# Altium schematic sheet Controller.SchDoc
size A1
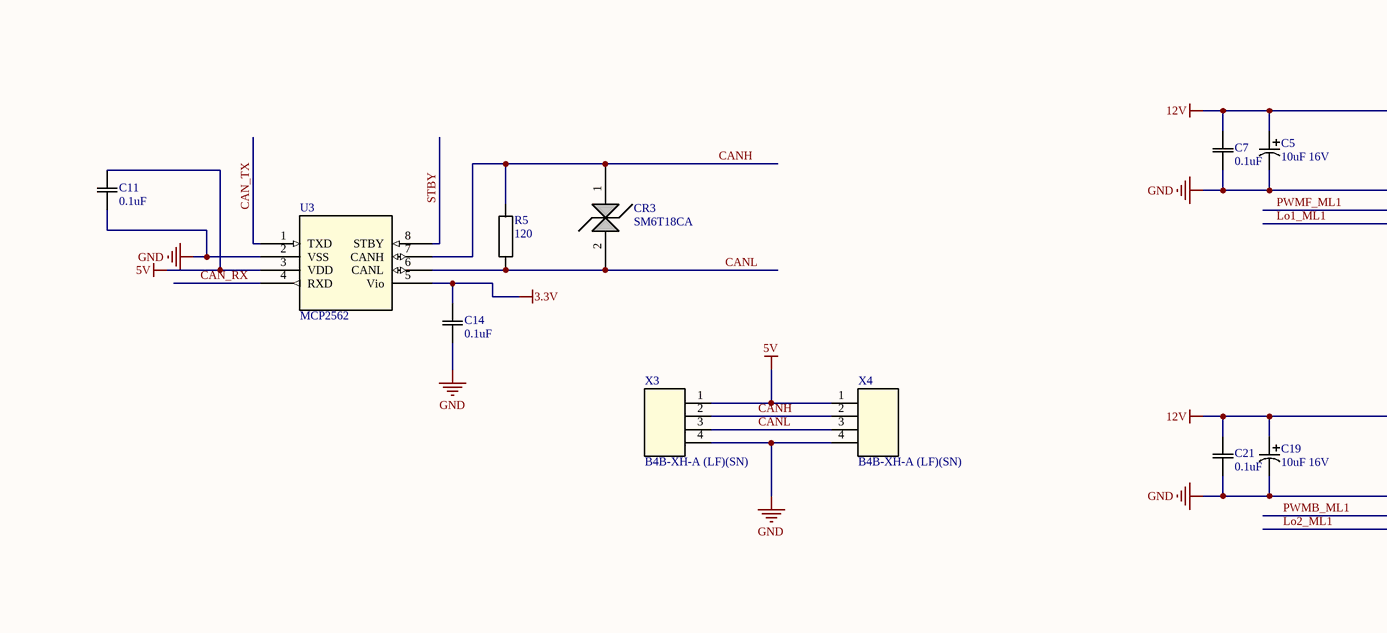
[diagram p0: Controller.SchDoc, top left]
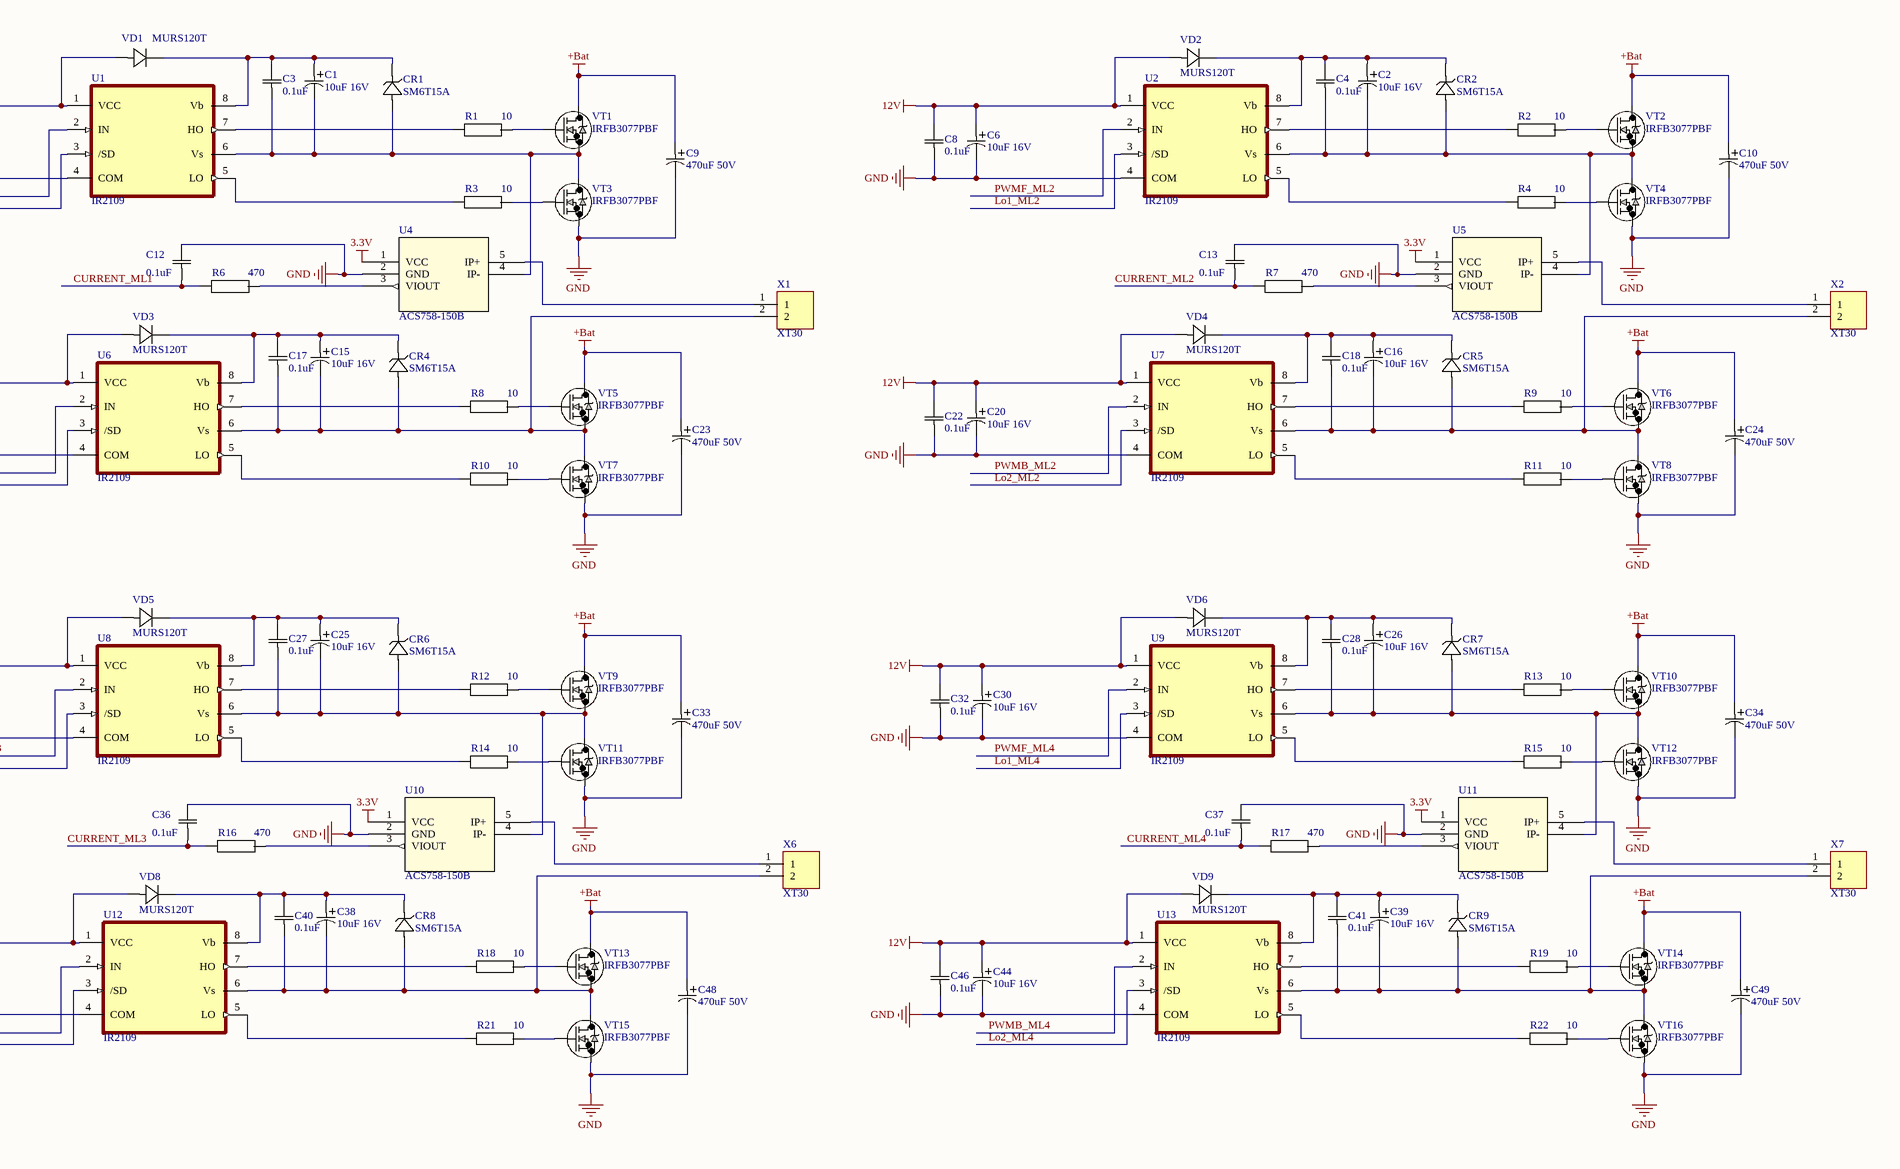
[diagram p1: Controller.SchDoc, top right]
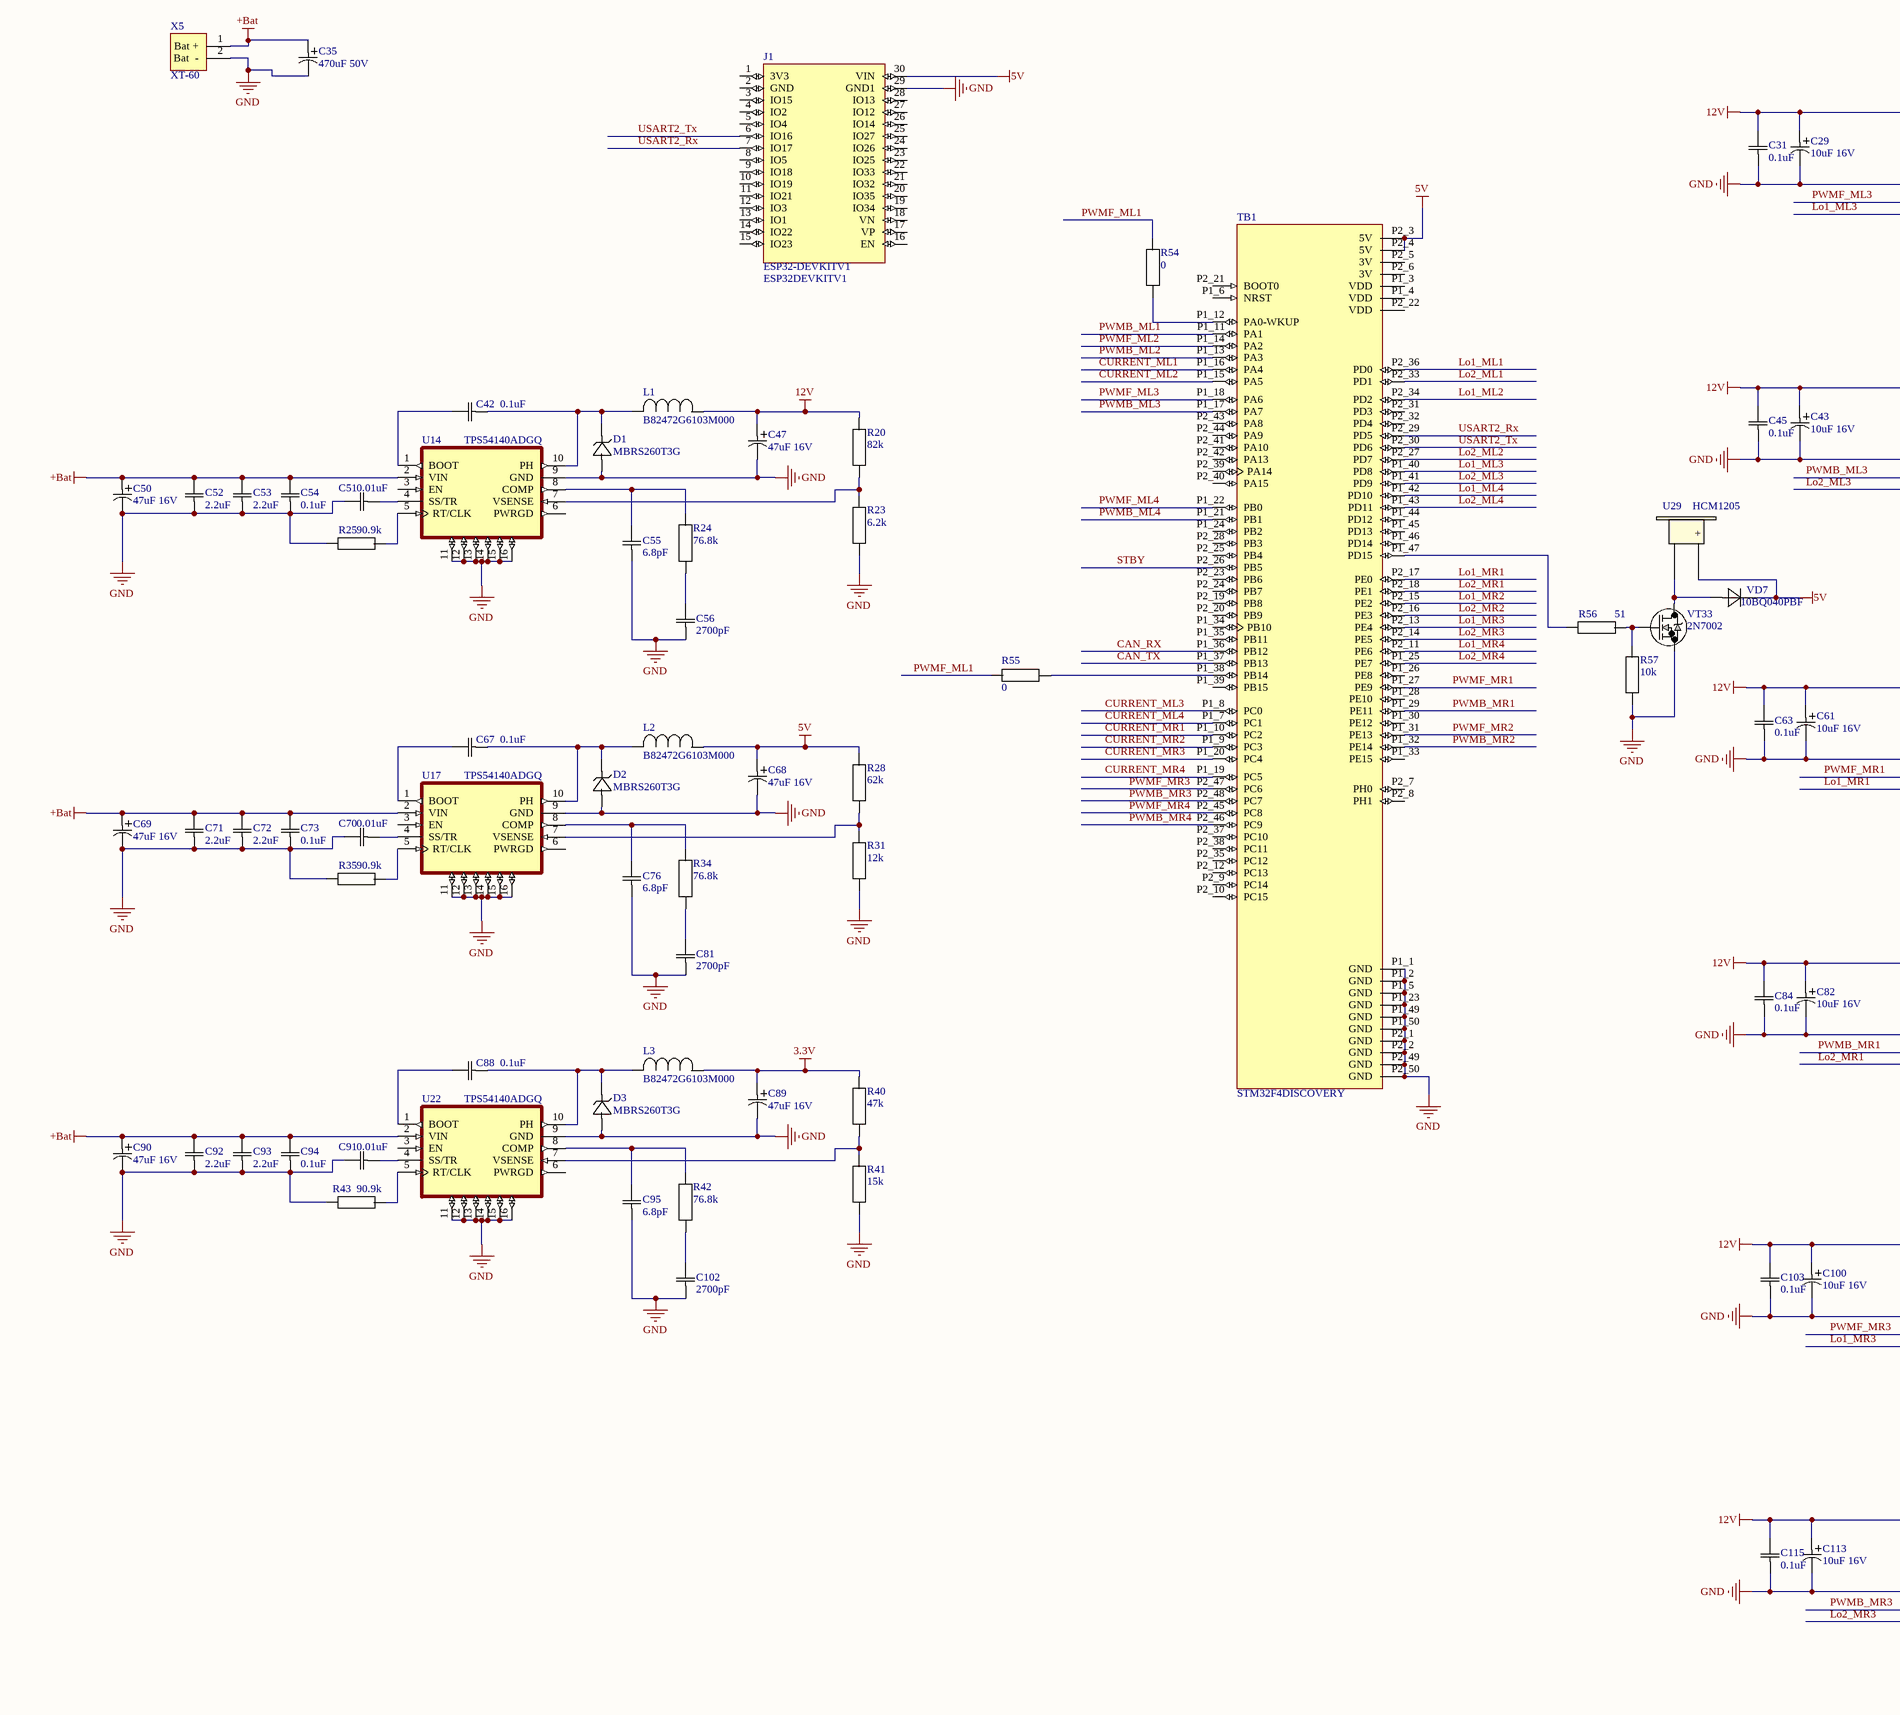
[diagram p2: Controller.SchDoc, bottom left]
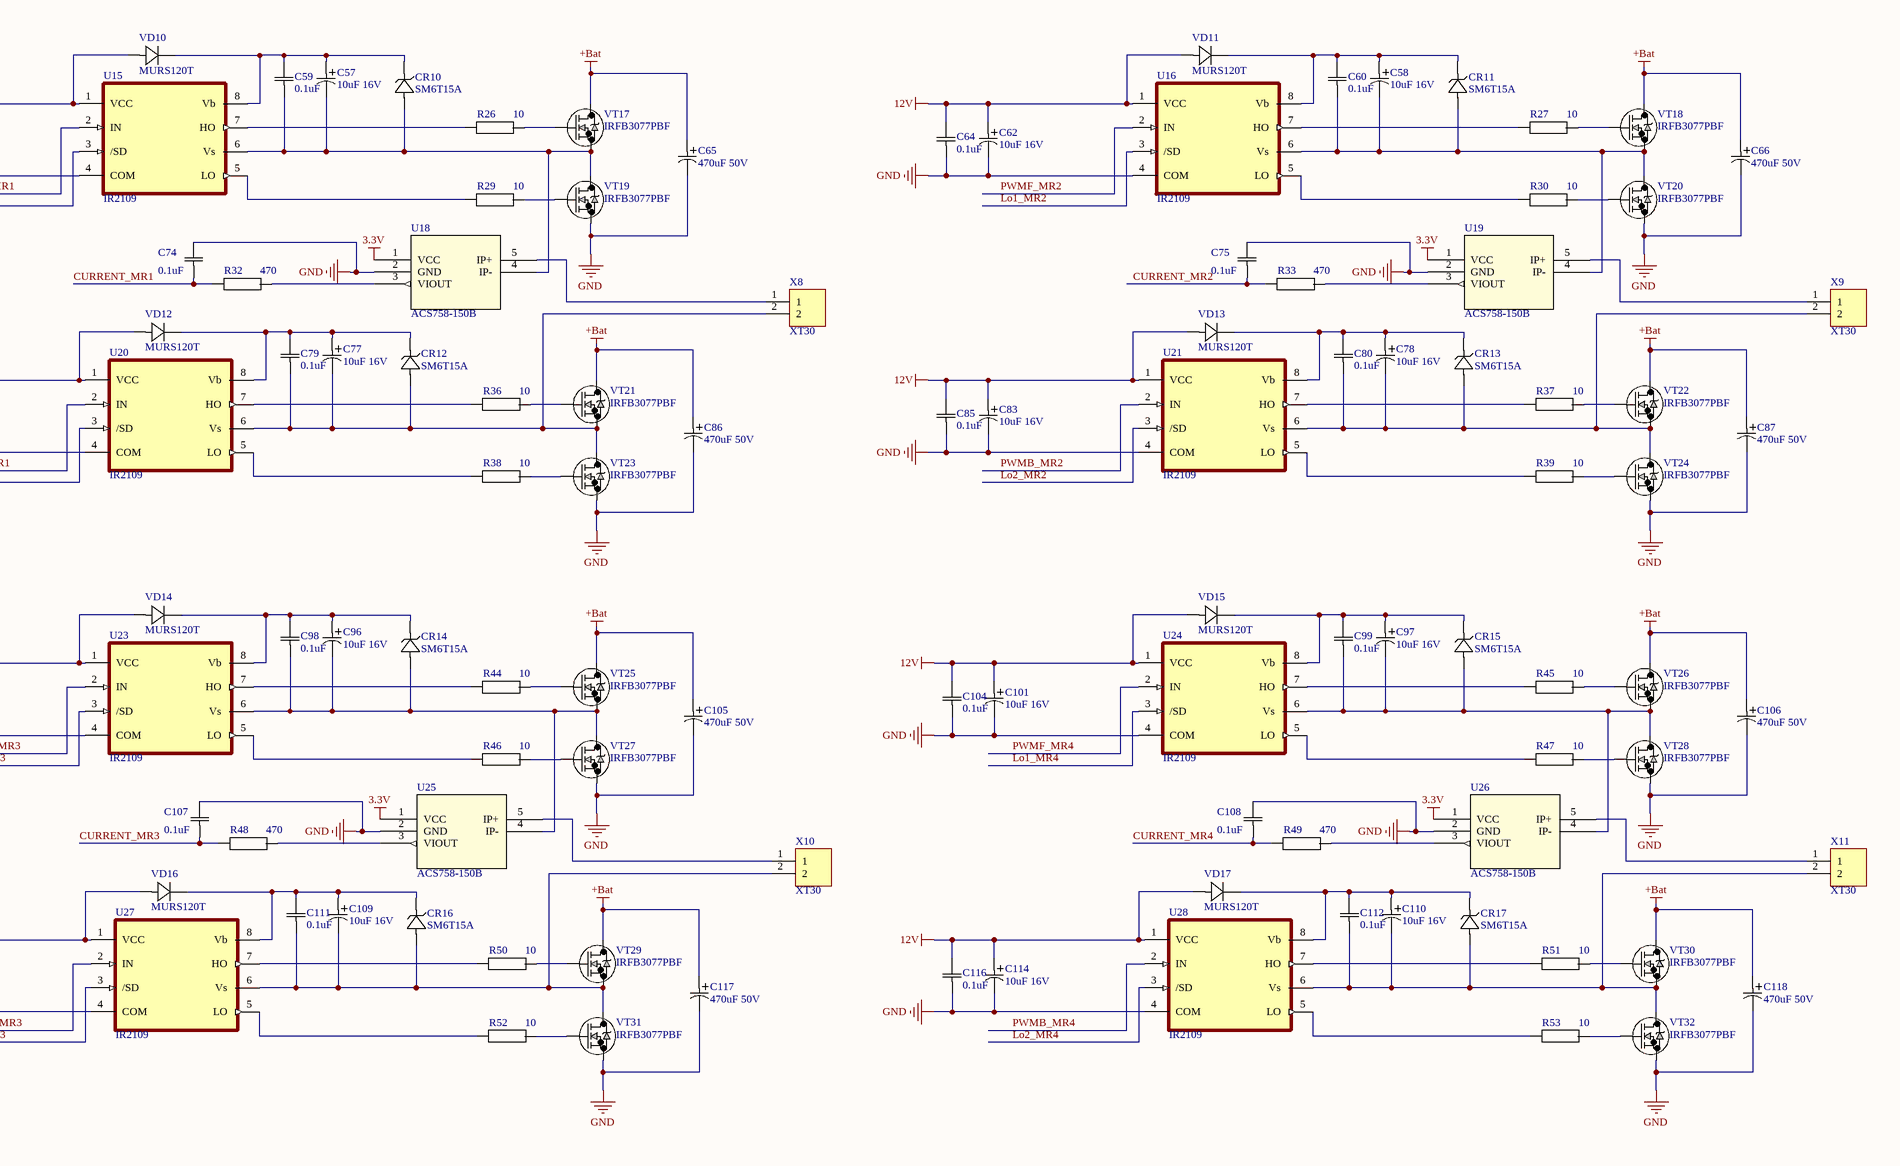
[diagram p3: Controller.SchDoc, bottom right]

## Parts
C1  10uF 16V  [PCAP_5x11-THRU-E]
C2  10uF 16V  [PCAP_5x11-THRU-E]
C3  0.1uF  [0603]
C4  0.1uF  [0603]
C5  10uF 16V  [PCAP_5x11-THRU-E]
C6  10uF 16V  [PCAP_5x11-THRU-E]
C7  0.1uF  [0603]
C8  0.1uF  [0603]
C9  470uF 50V  [CAP_UAQ_12P5X20]
C10  470uF 50V  [CAP_UAQ_12P5X20]
C11  0.1uF  [0603]
C12  0.1uF  [0603]
C13  0.1uF  [0603]
C14  0.1uF  [0603]
C15  10uF 16V  [PCAP_5x11-THRU-E]
C16  10uF 16V  [PCAP_5x11-THRU-E]
C17  0.1uF  [0603]
C18  0.1uF  [0603]
C19  10uF 16V  [PCAP_5x11-THRU-E]
C20  10uF 16V  [PCAP_5x11-THRU-E]
C21  0.1uF  [0603]
C22  0.1uF  [0603]
C23  470uF 50V  [CAP_UAQ_12P5X20]
C24  470uF 50V  [CAP_UAQ_12P5X20]
C25  10uF 16V  [PCAP_5x11-THRU-E]
C26  10uF 16V  [PCAP_5x11-THRU-E]
C27  0.1uF  [0603]
C28  0.1uF  [0603]
C29  10uF 16V  [PCAP_5x11-THRU-E]
C30  10uF 16V  [PCAP_5x11-THRU-E]
C31  0.1uF  [0603]
C32  0.1uF  [0603]
C33  470uF 50V  [CAP_UAQ_12P5X20]
C34  470uF 50V  [CAP_UAQ_12P5X20]
C35  470uF 50V  [CAP_UAQ_12P5X20]
C36  0.1uF  [0603]
C37  0.1uF  [0603]
C38  10uF 16V  [PCAP_5x11-THRU-E]
C39  10uF 16V  [PCAP_5x11-THRU-E]
C40  0.1uF  [0603]
C41  0.1uF  [0603]
C42  0.1uF  [0603]
C43  10uF 16V  [PCAP_5x11-THRU-E]
C44  10uF 16V  [PCAP_5x11-THRU-E]
C45  0.1uF  [0603]
C46  0.1uF  [0603]
C47  47uF 16V  [PCAP_5x11-THRU-E]
C48  470uF 50V  [CAP_UAQ_12P5X20]
C49  470uF 50V  [CAP_UAQ_12P5X20]
C50  47uF 16V  [PCAP_5x11-THRU-E]
C51  0.01uF  [0603]
C52  2.2uF  [CAP_0805J_AVX]
C53  2.2uF  [CAP_0805J_AVX]
C54  0.1uF  [0603]
C55  6.8pF  [0603]
C56  2700pF  [0603]
C57  10uF 16V  [PCAP_5x11-THRU-E]
C58  10uF 16V  [PCAP_5x11-THRU-E]
C59  0.1uF  [0603]
C60  0.1uF  [0603]
C61  10uF 16V  [PCAP_5x11-THRU-E]
C62  10uF 16V  [PCAP_5x11-THRU-E]
C63  0.1uF  [0603]
C64  0.1uF  [0603]
C65  470uF 50V  [CAP_UAQ_12P5X20]
C66  470uF 50V  [CAP_UAQ_12P5X20]
C67  0.1uF  [0603]
C68  47uF 16V  [PCAP_5x11-THRU-E]
C69  47uF 16V  [PCAP_5x11-THRU-E]
C70  0.01uF  [0603]
C71  2.2uF  [CAP_0805J_AVX]
C72  2.2uF  [CAP_0805J_AVX]
C73  0.1uF  [0603]
C74  0.1uF  [0603]
C75  0.1uF  [0603]
C76  6.8pF  [0603]
C77  10uF 16V  [PCAP_5x11-THRU-E]
C78  10uF 16V  [PCAP_5x11-THRU-E]
C79  0.1uF  [0603]
C80  0.1uF  [0603]
C81  2700pF  [0603]
C82  10uF 16V  [PCAP_5x11-THRU-E]
C83  10uF 16V  [PCAP_5x11-THRU-E]
C84  0.1uF  [0603]
C85  0.1uF  [0603]
C86  470uF 50V  [CAP_UAQ_12P5X20]
C87  470uF 50V  [CAP_UAQ_12P5X20]
C88  0.1uF  [0603]
C89  47uF 16V  [PCAP_5x11-THRU-E]
C90  47uF 16V  [PCAP_5x11-THRU-E]
C91  0.01uF  [0603]
C92  2.2uF  [CAP_0805J_AVX]
C93  2.2uF  [CAP_0805J_AVX]
C94  0.1uF  [0603]
C95  6.8pF  [0603]
C96  10uF 16V  [PCAP_5x11-THRU-E]
C97  10uF 16V  [PCAP_5x11-THRU-E]
C98  0.1uF  [0603]
C99  0.1uF  [0603]
C100  10uF 16V  [PCAP_5x11-THRU-E]
C101  10uF 16V  [PCAP_5x11-THRU-E]
C102  2700pF  [0603]
C103  0.1uF  [0603]
C104  0.1uF  [0603]
C105  470uF 50V  [CAP_UAQ_12P5X20]
C106  470uF 50V  [CAP_UAQ_12P5X20]
C107  0.1uF  [0603]
C108  0.1uF  [0603]
C109  10uF 16V  [PCAP_5x11-THRU-E]
C110  10uF 16V  [PCAP_5x11-THRU-E]
C111  0.1uF  [0603]
C112  0.1uF  [0603]
C113  10uF 16V  [PCAP_5x11-THRU-E]
C114  10uF 16V  [PCAP_5x11-THRU-E]
C115  0.1uF  [0603]
C116  0.1uF  [0603]
C117  470uF 50V  [CAP_UAQ_12P5X20]
C118  470uF 50V  [CAP_UAQ_12P5X20]
CR1  SM6T15A  [SMB_STM]
CR2  SM6T15A  [SMB_STM]
CR3  SM6T18CA  [SMB_STM]
CR4  SM6T15A  [SMB_STM]
CR5  SM6T15A  [SMB_STM]
CR6  SM6T15A  [SMB_STM]
CR7  SM6T15A  [SMB_STM]
CR8  SM6T15A  [SMB_STM]
CR9  SM6T15A  [SMB_STM]
CR10  SM6T15A  [SMB_STM]
CR11  SM6T15A  [SMB_STM]
CR12  SM6T15A  [SMB_STM]
CR13  SM6T15A  [SMB_STM]
CR14  SM6T15A  [SMB_STM]
CR15  SM6T15A  [SMB_STM]
CR16  SM6T15A  [SMB_STM]
CR17  SM6T15A  [SMB_STM]
D1  MBRS260T3G  [SMB]
D2  MBRS260T3G  [SMB]
D3  MBRS260T3G  [SMB]
J1  ESP32DEVKITV1  [ESP32-DEVKITV1]
L1  B82472G6103M000  [IND_EPCOS_B82472G6_EPC]
L2  B82472G6103M000  [IND_EPCOS_B82472G6_EPC]
L3  B82472G6103M000  [IND_EPCOS_B82472G6_EPC]
R1  10  [RC0603N]
R2  10  [RC0603N]
R3  10  [RC0603N]
R4  10  [RC0603N]
R5  120  [RC0603N]
R6  470  [RC0603N]
R7  470  [RC0603N]
R8  10  [RC0603N]
R9  10  [RC0603N]
R10  10  [RC0603N]
R11  10  [RC0603N]
R12  10  [RC0603N]
R13  10  [RC0603N]
R14  10  [RC0603N]
R15  10  [RC0603N]
R16  470  [RC0603N]
R17  470  [RC0603N]
R18  10  [RC0603N]
R19  10  [RC0603N]
R20  82k  [RC0603N]
R21  10  [RC0603N]
R22  10  [RC0603N]
R23  6.2k  [RC0603N]
R24  76.8k  [RC0603N]
R25  90.9k  [RC0603N]
R26  10  [RC0603N]
R27  10  [RC0603N]
R28  62k  [RC0603N]
R29  10  [RC0603N]
R30  10  [RC0603N]
R31  12k  [RC0603N]
R32  470  [RC0603N]
R33  470  [RC0603N]
R34  76.8k  [RC0603N]
R35  90.9k  [RC0603N]
R36  10  [RC0603N]
R37  10  [RC0603N]
R38  10  [RC0603N]
R39  10  [RC0603N]
R40  47k  [RC0603N]
R41  15k  [RC0603N]
R42  76.8k  [RC0603N]
R43  90.9k  [RC0603N]
R44  10  [RC0603N]
R45  10  [RC0603N]
R46  10  [RC0603N]
R47  10  [RC0603N]
R48  470  [RC0603N]
R49  470  [RC0603N]
R50  10  [RC0603N]
R51  10  [RC0603N]
R52  10  [RC0603N]
R53  10  [RC0603N]
R54  0  [RC0603N]
R55  0  [RC0603N]
R56  51  [RC0603N]
R57  10k  [RC0603N]
TB1  STM32F4DISCOVERY  [MODULE_STM32F4DISCOVERY]
U1  IR2109  [SOIC127P600X175-8N]
U2  IR2109  [SOIC127P600X175-8N]
U3  MCP2562  [SOIC8-N_MC_MCH]
U4  ACS758-150B  [PFF-5_ALM]
U5  ACS758-150B  [PFF-5_ALM]
U6  IR2109  [SOIC127P600X175-8N]
U7  IR2109  [SOIC127P600X175-8N]
U8  IR2109  [SOIC127P600X175-8N]
U9  IR2109  [SOIC127P600X175-8N]
U10  ACS758-150B  [PFF-5_ALM]
U11  ACS758-150B  [PFF-5_ALM]
U12  IR2109  [SOIC127P600X175-8N]
U13  IR2109  [SOIC127P600X175-8N]
U14  TPS54140ADGQ  [IC_XTR111AIDGQR]
U15  IR2109  [SOIC127P600X175-8N]
U16  IR2109  [SOIC127P600X175-8N]
U17  TPS54140ADGQ  [IC_XTR111AIDGQR]
U18  ACS758-150B  [PFF-5_ALM]
U19  ACS758-150B  [PFF-5_ALM]
U20  IR2109  [SOIC127P600X175-8N]
U21  IR2109  [SOIC127P600X175-8N]
U22  TPS54140ADGQ  [IC_XTR111AIDGQR]
U23  IR2109  [SOIC127P600X175-8N]
U24  IR2109  [SOIC127P600X175-8N]
U25  ACS758-150B  [PFF-5_ALM]
U26  ACS758-150B  [PFF-5_ALM]
U27  IR2109  [SOIC127P600X175-8N]
U28  IR2109  [SOIC127P600X175-8N]
U29  HCM1205  [KXG1205CL]
VD1  MURS120T  [DIOM5436X247N]
VD2  MURS120T  [DIOM5436X247N]
VD3  MURS120T  [DIOM5436X247N]
VD4  MURS120T  [DIOM5436X247N]
VD5  MURS120T  [DIOM5436X247N]
VD6  MURS120T  [DIOM5436X247N]
VD7  10BQ040PBF  [DIODE_SMB]
VD8  MURS120T  [DIOM5436X247N]
VD9  MURS120T  [DIOM5436X247N]
VD10  MURS120T  [DIOM5436X247N]
VD11  MURS120T  [DIOM5436X247N]
VD12  MURS120T  [DIOM5436X247N]
VD13  MURS120T  [DIOM5436X247N]
VD14  MURS120T  [DIOM5436X247N]
VD15  MURS120T  [DIOM5436X247N]
VD16  MURS120T  [DIOM5436X247N]
VD17  MURS120T  [DIOM5436X247N]
VT1  IRFB3077PBF  [PG-TO220-3]
VT2  IRFB3077PBF  [PG-TO220-3]
VT3  IRFB3077PBF  [PG-TO220-3]
VT4  IRFB3077PBF  [PG-TO220-3]
VT5  IRFB3077PBF  [PG-TO220-3]
VT6  IRFB3077PBF  [PG-TO220-3]
VT7  IRFB3077PBF  [PG-TO220-3]
VT8  IRFB3077PBF  [PG-TO220-3]
VT9  IRFB3077PBF  [PG-TO220-3]
VT10  IRFB3077PBF  [PG-TO220-3]
VT11  IRFB3077PBF  [PG-TO220-3]
VT12  IRFB3077PBF  [PG-TO220-3]
VT13  IRFB3077PBF  [PG-TO220-3]
VT14  IRFB3077PBF  [PG-TO220-3]
VT15  IRFB3077PBF  [PG-TO220-3]
VT16  IRFB3077PBF  [PG-TO220-3]
VT17  IRFB3077PBF  [PG-TO220-3]
VT18  IRFB3077PBF  [PG-TO220-3]
VT19  IRFB3077PBF  [PG-TO220-3]
VT20  IRFB3077PBF  [PG-TO220-3]
VT21  IRFB3077PBF  [PG-TO220-3]
VT22  IRFB3077PBF  [PG-TO220-3]
VT23  IRFB3077PBF  [PG-TO220-3]
VT24  IRFB3077PBF  [PG-TO220-3]
VT25  IRFB3077PBF  [PG-TO220-3]
VT26  IRFB3077PBF  [PG-TO220-3]
VT27  IRFB3077PBF  [PG-TO220-3]
VT28  IRFB3077PBF  [PG-TO220-3]
VT29  IRFB3077PBF  [PG-TO220-3]
VT30  IRFB3077PBF  [PG-TO220-3]
VT31  IRFB3077PBF  [PG-TO220-3]
VT32  IRFB3077PBF  [PG-TO220-3]
VT33  2N7002  [TO-236AB]
X1  XT30  [XT30]
X2  XT30  [XT30]
X3  B4B-XH-A (LF)(SN)  [CONN_B4B-XH-A (L]
X4  B4B-XH-A (LF)(SN)  [CONN_B4B-XH-A (L]
X5  XT-60  [XT-60]
X6  XT30  [XT30]
X7  XT30  [XT30]
X8  XT30  [XT30]
X9  XT30  [XT30]
X10  XT30  [XT30]
X11  XT30  [XT30]

## Nets
3.3V: C14.2 C89.1 L3.1 R40.1 U3.5(Vio) U4.1(VCC) U5.1(VCC) U10.1(VCC) U11.1(VCC) U18.1(VCC) U19.1(VCC) U25.1(VCC) U26.1(VCC)
5V: C11.2 C68.1 J1.30(VIN) L2.1 R28.1 TB1.P2_3(5V) TB1.P2_4(5V) U3.3(VDD) U29.2(+) VD7.1 X3.1 X4.1
12V: C5.1 C6.1 C7.2 C8.2 C19.1 C20.1 C21.2 C22.2 C29.1 C30.1 C31.2 C32.2 C43.1 C44.1 C45.2 C46.2 C47.1 C61.1 C62.1 C63.2 C64.2 C82.1 C83.1 C84.2 C85.2 C100.1 C101.1 C103.2 C104.2 C113.1 C114.1 C115.2 C116.2 L1.1 R20.1 U1.1(VCC) U2.1(VCC) U6.1(VCC) U7.1(VCC) U8.1(VCC) U9.1(VCC) U12.1(VCC) U13.1(VCC) U15.1(VCC) U16.1(VCC) U20.1(VCC) U21.1(VCC) U23.1(VCC) U24.1(VCC) U27.1(VCC) U28.1(VCC) VD1.2 VD2.2 VD3.2 VD4.2 VD5.2 VD6.2 VD8.2 VD9.2 VD10.2 VD11.2 VD12.2 VD13.2 VD14.2 VD15.2 VD16.2 VD17.2
+Bat: C9.1 C10.1 C23.1 C24.1 C33.1 C34.1 C35.1 C48.1 C49.1 C50.1 C52.2 C53.2 C54.2 C65.1 C66.1 C69.1 C71.2 C72.2 C73.2 C86.1 C87.1 C90.1 C92.2 C93.2 C94.2 C105.1 C106.1 C117.1 C118.1 U14.2(VIN) U17.2(VIN) U22.2(VIN) VT1.2 VT2.2 VT5.2 VT6.2 VT9.2 VT10.2 VT13.2 VT14.2 VT17.2 VT18.2 VT21.2 VT22.2 VT25.2 VT26.2 VT29.2 VT30.2 X5.1(Bat_+)
GND: C5.2 C6.2 C7.1 C8.1 C9.2 C10.2 C11.1 C12.2 C13.2 C14.1 C19.2 C20.2 C21.1 C22.1 C23.2 C24.2 C29.2 C30.2 C31.1 C32.1 C33.2 C34.2 C35.2 C36.2 C37.2 C43.2 C44.2 C45.1 C46.1 C47.2 C48.2 C49.2 C50.2 C51.2 C52.1 C53.1 C54.1 C55.1 C56.1 C61.2 C62.2 C63.1 C64.1 C65.2 C66.2 C68.2 C69.2 C70.2 C71.1 C72.1 C73.1 C74.2 C75.2 C76.1 C81.1 C82.2 C83.2 C84.1 C85.1 C86.2 C87.2 C89.2 C90.2 C91.2 C92.1 C93.1 C94.1 C95.1 C100.2 C101.2 C102.1 C103.1 C104.1 C105.2 C106.2 C107.2 C108.2 C113.2 C114.2 C115.1 C116.1 C117.2 C118.2 D1.A D2.A D3.A J1.29(GND1) R23.2 R25.2 R31.2 R35.2 R41.2 R43.2 R57.2 TB1.P1_1(GND) TB1.P1_2(GND) TB1.P1_5(GND) TB1.P1_23(GND) TB1.P1_49(GND) TB1.P1_50(GND) TB1.P2_1(GND) TB1.P2_2(GND) TB1.P2_49(GND) TB1.P2_50(GND) U1.4(COM) U2.4(COM) U3.2(VSS) U4.2(GND) U5.2(GND) U6.4(COM) U7.4(COM) U8.4(COM) U9.4(COM) U10.2(GND) U11.2(GND) U12.4(COM) U13.4(COM) U14.9(GND) U14.11(THERMALPAD) U14.12(THERMALPAD) U14.13(THERMALPAD) U14.14(THERMALPAD) U14.15(THERMALPAD) U14.16(THERMALPAD) U15.4(COM) U16.4(COM) U17.9(GND) U17.11(THERMALPAD) U17.12(THERMALPAD) U17.13(THERMALPAD) U17.14(THERMALPAD) U17.15(THERMALPAD) U17.16(THERMALPAD) U18.2(GND) U19.2(GND) U20.4(COM) U21.4(COM) U22.9(GND) U22.11(THERMALPAD) U22.12(THERMALPAD) U22.13(THERMALPAD) U22.14(THERMALPAD) U22.15(THERMALPAD) U22.16(THERMALPAD) U23.4(COM) U24.4(COM) U25.2(GND) U26.2(GND) U27.4(COM) U28.4(COM) VT3.3 VT4.3 VT7.3 VT8.3 VT11.3 VT12.3 VT15.3 VT16.3 VT19.3 VT20.3 VT23.3 VT24.3 VT27.3 VT28.3 VT31.3 VT32.3 VT33.2 X3.4 X4.4 X5.2(Bat__-)
CAN_RX: TB1.P1_36(PB12) U3.4(RXD)
CAN_TX: TB1.P1_37(PB13) U3.1(TXD)
CANH: CR3.1(CATHODE) R5.1 U3.7(CANH) X3.2 X4.2
CANL: CR3.2(ANODE) R5.2 U3.6(CANL) X3.3 X4.3
CURRENT_ML1: C12.1 R6.2 TB1.P1_16(PA4)
CURRENT_ML2: C13.1 R7.2 TB1.P1_15(PA5)
CURRENT_ML3: C36.1 R16.2 TB1.P1_8(PC0)
CURRENT_ML4: C37.1 R17.2 TB1.P1_7(PC1)
CURRENT_MR1: C74.1 R32.2 TB1.P1_10(PC2)
CURRENT_MR2: C75.1 R33.2 TB1.P1_9(PC3)
CURRENT_MR3: C107.1 R48.2 TB1.P1_20(PC4)
CURRENT_MR4: C108.1 R49.2 TB1.P1_19(PC5)
Lo1_ML1: TB1.P2_36(PD0) U1.3(/SD)
Lo1_ML2: TB1.P2_34(PD2) U2.3(/SD)
Lo1_ML3: TB1.P1_40(PD8) U8.3(/SD)
Lo1_ML4: TB1.P1_42(PD10) U9.3(/SD)
Lo1_MR1: TB1.P2_17(PE0) U15.3(/SD)
Lo1_MR2: TB1.P2_15(PE2) U16.3(/SD)
Lo1_MR3: TB1.P2_13(PE4) U23.3(/SD)
Lo1_MR4: TB1.P2_11(PE6) U24.3(/SD)
Lo2_ML1: TB1.P2_33(PD1) U6.3(/SD)
Lo2_ML2: TB1.P2_27(PD7) U7.3(/SD)
Lo2_ML3: TB1.P1_41(PD9) U12.3(/SD)
Lo2_ML4: TB1.P1_43(PD11) U13.3(/SD)
Lo2_MR1: TB1.P2_18(PE1) U20.3(/SD)
Lo2_MR2: TB1.P2_16(PE3) U21.3(/SD)
Lo2_MR3: TB1.P2_14(PE5) U27.3(/SD)
Lo2_MR4: TB1.P1_25(PE7) U28.3(/SD)
PWMB_ML1: TB1.P1_11(PA1) U6.2(IN)
PWMB_ML2: TB1.P1_13(PA3) U7.2(IN)
PWMB_ML3: TB1.P1_17(PA7) U12.2(IN)
PWMB_ML4: TB1.P1_21(PB1) U13.2(IN)
PWMB_MR1: TB1.P1_29(PE11) U20.2(IN)
PWMB_MR2: TB1.P1_32(PE14) U21.2(IN)
PWMB_MR3: TB1.P2_48(PC7) U27.2(IN)
PWMB_MR4: TB1.P2_46(PC9) U28.2(IN)
PWMF_ML1: R54.1 R55.1 U1.2(IN)
PWMF_ML2: TB1.P1_14(PA2) U2.2(IN)
PWMF_ML3: TB1.P1_18(PA6) U8.2(IN)
PWMF_ML4: TB1.P1_22(PB0) U9.2(IN)
PWMF_MR1: TB1.P1_27(PE9) U15.2(IN)
PWMF_MR2: TB1.P1_31(PE13) U16.2(IN)
PWMF_MR3: TB1.P2_47(PC6) U23.2(IN)
PWMF_MR4: TB1.P2_45(PC8) U24.2(IN)
STBY: TB1.P2_26(PB5) U3.8(STBY)
USART2_Rx: J1.7(IO17) TB1.P2_29(PD5)
USART2_Tx: J1.6(IO16) TB1.P2_30(PD6)
NetC1_1: C1.1 C3.2 CR1.1 U1.8(Vb) VD1.1
NetC1_2: C1.2 C3.1 CR1.2 U1.6(Vs) U4.4(IP-) VT1.3 VT3.2
NetC2_1: C2.1 C4.2 CR2.1 U2.8(Vb) VD2.1
NetC2_2: C2.2 C4.1 CR2.2 U2.6(Vs) U5.4(IP-) VT2.3 VT4.2
NetC15_1: C15.1 C17.2 CR4.1 U6.8(Vb) VD3.1
NetC15_2: C15.2 C17.1 CR4.2 U6.6(Vs) VT5.3 VT7.2 X1.2
NetC16_1: C16.1 C18.2 CR5.1 U7.8(Vb) VD4.1
NetC16_2: C16.2 C18.1 CR5.2 U7.6(Vs) VT6.3 VT8.2 X2.2
NetC25_1: C25.1 C27.2 CR6.1 U8.8(Vb) VD5.1
NetC25_2: C25.2 C27.1 CR6.2 U8.6(Vs) U10.4(IP-) VT9.3 VT11.2
NetC26_1: C26.1 C28.2 CR7.1 U9.8(Vb) VD6.1
NetC26_2: C26.2 C28.1 CR7.2 U9.6(Vs) U11.4(IP-) VT10.3 VT12.2
NetC38_1: C38.1 C40.2 CR8.1 U12.8(Vb) VD8.1
NetC38_2: C38.2 C40.1 CR8.2 U12.6(Vs) VT13.3 VT15.2 X6.2
NetC39_1: C39.1 C41.2 CR9.1 U13.8(Vb) VD9.1
NetC39_2: C39.2 C41.1 CR9.2 U13.6(Vs) VT14.3 VT16.2 X7.2
NetC42_1: C42.1 D1.C L1.2 U14.10(PH)
NetC42_2: C42.2 U14.1(BOOT)
NetC51_1: C51.1 U14.4(SS/TR)
NetC55_2: C55.2 R24.1 U14.8(COMP)
NetC56_2: C56.2 R24.2
NetC57_1: C57.1 C59.2 CR10.1 U15.8(Vb) VD10.1
NetC57_2: C57.2 C59.1 CR10.2 U15.6(Vs) U18.4(IP-) VT17.3 VT19.2
NetC58_1: C58.1 C60.2 CR11.1 U16.8(Vb) VD11.1
NetC58_2: C58.2 C60.1 CR11.2 U16.6(Vs) U19.4(IP-) VT18.3 VT20.2
NetC67_1: C67.1 D2.C L2.2 U17.10(PH)
NetC67_2: C67.2 U17.1(BOOT)
NetC70_1: C70.1 U17.4(SS/TR)
NetC76_2: C76.2 R34.1 U17.8(COMP)
NetC77_1: C77.1 C79.2 CR12.1 U20.8(Vb) VD12.1
NetC77_2: C77.2 C79.1 CR12.2 U20.6(Vs) VT21.3 VT23.2 X8.2
NetC78_1: C78.1 C80.2 CR13.1 U21.8(Vb) VD13.1
NetC78_2: C78.2 C80.1 CR13.2 U21.6(Vs) VT22.3 VT24.2 X9.2
NetC81_2: C81.2 R34.2
NetC88_1: C88.1 D3.C L3.2 U22.10(PH)
NetC88_2: C88.2 U22.1(BOOT)
NetC91_1: C91.1 U22.4(SS/TR)
NetC95_2: C95.2 R42.1 U22.8(COMP)
NetC96_1: C96.1 C98.2 CR14.1 U23.8(Vb) VD14.1
NetC96_2: C96.2 C98.1 CR14.2 U23.6(Vs) U25.4(IP-) VT25.3 VT27.2
NetC97_1: C97.1 C99.2 CR15.1 U24.8(Vb) VD15.1
NetC97_2: C97.2 C99.1 CR15.2 U24.6(Vs) U26.4(IP-) VT26.3 VT28.2
NetC102_2: C102.2 R42.2
NetC109_1: C109.1 C111.2 CR16.1 U27.8(Vb) VD16.1
NetC109_2: C109.2 C111.1 CR16.2 U27.6(Vs) VT29.3 VT31.2 X10.2
NetC110_1: C110.1 C112.2 CR17.1 U28.8(Vb) VD17.1
NetC110_2: C110.2 C112.1 CR17.2 U28.6(Vs) VT30.3 VT32.2 X11.2
NetR1_1: R1.1 VT1.1
NetR1_2: R1.2 U1.7(HO)
NetR2_1: R2.1 VT2.1
NetR2_2: R2.2 U2.7(HO)
NetR3_1: R3.1 VT3.1
NetR3_2: R3.2 U1.5(LO)
NetR4_1: R4.1 VT4.1
NetR4_2: R4.2 U2.5(LO)
NetR6_1: R6.1 U4.3(VIOUT)
NetR7_1: R7.1 U5.3(VIOUT)
NetR8_1: R8.1 VT5.1
NetR8_2: R8.2 U6.7(HO)
NetR9_1: R9.1 VT6.1
NetR9_2: R9.2 U7.7(HO)
NetR10_1: R10.1 VT7.1
NetR10_2: R10.2 U6.5(LO)
NetR11_1: R11.1 VT8.1
NetR11_2: R11.2 U7.5(LO)
NetR12_1: R12.1 VT9.1
NetR12_2: R12.2 U8.7(HO)
NetR13_1: R13.1 VT10.1
NetR13_2: R13.2 U9.7(HO)
NetR14_1: R14.1 VT11.1
NetR14_2: R14.2 U8.5(LO)
NetR15_1: R15.1 VT12.1
NetR15_2: R15.2 U9.5(LO)
NetR16_1: R16.1 U10.3(VIOUT)
NetR17_1: R17.1 U11.3(VIOUT)
NetR18_1: R18.1 VT13.1
NetR18_2: R18.2 U12.7(HO)
NetR19_1: R19.1 VT14.1
NetR19_2: R19.2 U13.7(HO)
NetR20_2: R20.2 R23.1 U14.7(VSENSE)
NetR21_1: R21.1 VT15.1
NetR21_2: R21.2 U12.5(LO)
NetR22_1: R22.1 VT16.1
NetR22_2: R22.2 U13.5(LO)
NetR25_1: R25.1 U14.5(RT/CLK)
NetR26_1: R26.1 VT17.1
NetR26_2: R26.2 U15.7(HO)
NetR27_1: R27.1 VT18.1
NetR27_2: R27.2 U16.7(HO)
NetR28_2: R28.2 R31.1 U17.7(VSENSE)
NetR29_1: R29.1 VT19.1
NetR29_2: R29.2 U15.5(LO)
NetR30_1: R30.1 VT20.1
NetR30_2: R30.2 U16.5(LO)
NetR32_1: R32.1 U18.3(VIOUT)
NetR33_1: R33.1 U19.3(VIOUT)
NetR35_1: R35.1 U17.5(RT/CLK)
NetR36_1: R36.1 VT21.1
NetR36_2: R36.2 U20.7(HO)
NetR37_1: R37.1 VT22.1
NetR37_2: R37.2 U21.7(HO)
NetR38_1: R38.1 VT23.1
NetR38_2: R38.2 U20.5(LO)
NetR39_1: R39.1 VT24.1
NetR39_2: R39.2 U21.5(LO)
NetR40_2: R40.2 R41.1 U22.7(VSENSE)
NetR43_1: R43.1 U22.5(RT/CLK)
NetR44_1: R44.1 VT25.1
NetR44_2: R44.2 U23.7(HO)
NetR45_1: R45.1 VT26.1
NetR45_2: R45.2 U24.7(HO)
NetR46_1: R46.1 VT27.1
NetR46_2: R46.2 U23.5(LO)
NetR47_1: R47.1 VT28.1
NetR47_2: R47.2 U24.5(LO)
NetR48_1: R48.1 U25.3(VIOUT)
NetR49_1: R49.1 U26.3(VIOUT)
NetR50_1: R50.1 VT29.1
NetR50_2: R50.2 U27.7(HO)
NetR51_1: R51.1 VT30.1
NetR51_2: R51.2 U28.7(HO)
NetR52_1: R52.1 VT31.1
NetR52_2: R52.2 U27.5(LO)
NetR53_1: R53.1 VT32.1
NetR53_2: R53.2 U28.5(LO)
NetR54_2: R54.2 TB1.P1_12(PA0-WKUP)
NetR55_2: R55.2 TB1.P1_38(PB14)
NetR56_1: R56.1 R57.1 VT33.1
NetR56_2: R56.2 TB1.P1_47(PD15)
NetU4_5: U4.5(IP+) X1.1
NetU5_5: U5.5(IP+) X2.1
NetU10_5: U10.5(IP+) X6.1
NetU11_5: U11.5(IP+) X7.1
NetU18_5: U18.5(IP+) X8.1
NetU19_5: U19.5(IP+) X9.1
NetU25_5: U25.5(IP+) X10.1
NetU26_5: U26.5(IP+) X11.1
NetU29_1: U29.1 VD7.2 VT33.3

Not connected (* = marked no-connect by the designer): J1 1(3V3) 2(GND) 3(IO15) 4(IO2) 5(IO4) 8(IO5) 9(IO18) 10(IO19) 11(IO21) 12(IO3) 13(IO1) 14(IO22) 15(IO23) 16(EN) 17(VP) 18(VN) 19(IO34) 20(IO35) 21(IO32) 22(IO33) 23(IO25) 24(IO26) 25(IO27) 26(IO14) 27(IO12) 28(IO13); TB1 P1_3(VDD) P1_4(VDD) P1_6(NRST) P1_24(PB2) P1_26(PE8) P1_28(PE10) P1_30(PE12) P1_33(PE15) P1_34(PB10) P1_35(PB11) P1_39(PB15) P1_44(PD12) P1_45(PD13) P1_46(PD14) P2_5(3V) P2_6(3V) P2_7(PH0) P2_8(PH1) P2_9(PC14) P2_10(PC15) P2_12(PC13) P2_19(PB8) P2_20(PB9) P2_21(BOOT0) P2_22(VDD) P2_23(PB6) P2_24(PB7) P2_25(PB4) P2_28(PB3) P2_31(PD3) P2_32(PD4) P2_35(PC12) P2_37(PC10) P2_38(PC11) P2_39(PA14) P2_40(PA15) P2_41(PA10) P2_42(PA13) P2_43(PA8) P2_44(PA9); U14 3(EN) 6(PWRGD); U17 3(EN) 6(PWRGD); U22 3(EN) 6(PWRGD)

## Notes on the sheet
- (in symbol ESP32DEVKITV1) ESP32-DEVKITV1

## Library data of the parts
C1 C2 C5 C6 C15 C16 C19 C20 C25 C26 C29 C30 C38 C39 C43 C44 C47 C50 C57 C58 C61 C62 C68 C69 C77 C78 C82 C83 C89 C90 C96 C97 C100 C101 C109 C110 C113 C114 = UPS1C470MDD: No Description Available; Vendor: Nichicon; Built_By: EMA_UL_Team; Type: DEV; Manufacturer_Part_Number: UPS1C470MDD; Copyright: Copyright (C) 2018 Accelerated Designs. All rights reserved; RefDes: RefDes; Value: Value
C3 C4 C7 C8 C11-C14 C17 C18 C21 C22 C27 C28 C31 C32 C36 C37 C40-C42 C45 C46 C51 C54-C56 C59 C60 C63 C64 C67 C70 C73-C76 C79-C81 C84 C85 C88 C91 C94 C95 C98 C99 C102-C104 C107 C108 C111 C112 C115 C116 = 0603ZC224JAT2A: No Description Available; Vendor: AVX Corporation; Built_By: EMA_UL_Team; Type: DEV; Manufacturer_Part_Number: 0603ZC224JAT2A; Copyright: Copyright (C) 2018 Accelerated Designs. All rights reserved; RefDes: RefDes; Value: Value
C9 C10 C23 C24 C33-C35 C48 C49 C65 C66 C86 C87 C105 C106 C117 C118 = UVR1H471MHD1TO: No Description Available; Vendor: Nichicon; Built_By: EMA_Cory; Type: DEV; Manufacturer_Part_Number: UVR1H471MHD1TO; Copyright: Copyright (C) 2018 Accelerated Designs. All rights reserved; RefDes: RefDes; Value: Value
C52 C53 C71 C72 C92 C93 = 08051A102JAT2A: No Description Available; Built_By: EMA_UL_Team; Vendor: AVX Corporation; SourceLibrary: AVX_2016-12-14_2; Type: DEV; Manufacturer_Part_Number: 08051A102JAT2A; Copyright: Copyright (C) 2018 Accelerated Designs. All rights reserved; RefDes: RefDes
CR1 CR2 CR4-CR17 = SM6T15A: No Description Available; Vendor: STMicroelectronics; Built_By: EMA_UL_Team; SourceLibrary: Update_to_database_2020-12-07; Type: DEV; Manufacturer_Part_Number: SM6T15A; Copyright: Copyright (C) 2018 Accelerated Designs. All rights reserved; RefDes: RefDes
CR3 = SM6T18CA: No Description Available; Vendor: STMicroelectronics; Built_By: EMA_UL_Team; SourceLibrary: StMicro_2011-06-07; Type: DEV; Manufacturer_Part_Number: SM6T18CA; Copyright: Copyright (C) 2018 Accelerated Designs. All rights reserved; RefDes: RefDes
D1-D3 = MBRS260T3G: Diode Schottky 60V 2A Surface Mount SMB; MF: ON Semiconductor; SnapEDA_Link: https://www.snapeda.com/parts/MBRS260T3G/ON%20Semiconductor/view-part/356560/?ref=snap; Check_prices: https://www.snapeda.com/parts/MBRS260T3G/ON%20Semiconductor/view-part/356560/?ref=eda; MP: MBRS260T3G; Package: SMB-2 ON Semiconductor; Purchase-URL: https://pricing.snapeda.com/search/part/MBRS260T3G/?ref=eda; Value: *; Digi-Key_Part_Number: MBRS260T3GOSCT-ND
J1 = ESP32DEVKITV1: Dual core, Wi-Fi: 2.4 GHz up to 150 Mbits/s,BLE (Bluetooth Low Energy) and legacy Bluetooth, 32 bits, Up to 240 MHz; MF: Do it; Package: Package; Value: *; Availability: Unavailable; SnapEDA_Link: https://www.snapeda.com/parts/ESP32%20DEVKIT%20V1/Do%20it/view-part/5659245/?ref=snap; Price: None; MP: ESP32 DEVKIT V1; Check_prices: https://www.snapeda.com/parts/ESP32%20DEVKIT%20V1/Do%20it/view-part/5659245/?ref=eda
L1-L3 = B82472G6103M000: No Description Available; Vendor: Epcos; Built_By: EMA_UL_Team; SourceLibrary: Epcos_2010-01-01_Inductors; Type: DEV; Manufacturer_Part_Number: B82472G6103M000; Copyright: Copyright (C) 2018 Accelerated Designs. All rights reserved; RefDes: RefDes
R1-R57 = ERA-3AEB101V: No Description Available; Vendor: Panasonic; Built_By: EMA_UL_Team; Manufacturer_Part_Number: ERA-3AEB101V; Copyright: Copyright (C) 2018 Accelerated Designs. All rights reserved; RefDes: RefDes; Type: DEV; Value: Value
TB1 = STM32F4DISCOVERY: STM32F407VGT6 Discovery STM32F4 ARMÂ® CortexÂ®-M4 MCU 32-Bit Embedded Evaluation Board; MF: STMicroelectronics; MP: STM32F4DISCOVERY; Package: None; Price: None; Availability: Unavailable; Value: *; SnapEDA_Link: https://www.snapeda.com/parts/STM32F4DISCOVERY/STMicroelectronics/view-part/46335/?ref=snap
U1 U2 U6-U9 U12 U13 U15 U16 U20 U21 U23 U24 U27 U28 = IR2109: Floating channel designed for bootstrap operation | Fully operational to +600 V | Tolerant to negative transient voltage, dV/dt immune | Gate drive supply range from 10 V to 20 V | Undervoltage lockout for both channels | 3.3 V and 5 V input logic compatible | Matched propagation delay for both channels | Logic and power ground +/- 5 V offset | Lower di/dt gate driver for better noise immunity | Output source/sink current capability 4 A/4 A; MF: Infineon; Price: None; Availability: Good; Check_prices: https://www.snapeda.com/parts/IRS2186STRPBF/Infineon%20Technologies/view-part/563209/?ref=eda; MP: IR2109; Package: SOIC-8 Infineon; SnapEDA_Link: https://www.snapeda.com/parts/IRS2186STRPBF/Infineon%20Technologies/view-part/563209/?ref=snap; Value: *; Purchase-URL: https://pricing.snapeda.com/search/part/IRS2186STRPBF/?ref=eda
U3 = MCP2562: No Description Available; Vendor: Microchip; Built_By: EMA_Jessica; SourceLibrary: Microchip_2019-08-23_14; Manufacturer_Part_Number: MCP2562; Copyright: Copyright (C) 2018 Accelerated Designs. All rights reserved; RefDes: RefDes; Type: DEV
U4 U5 U10 U11 U18 U19 U25 U26 = ACS756SCA-050B-PFF-T: No Description Available; Vendor: Allegro Microsystems Inc.; Built_By: EMA_UL_Team; SourceLibrary: Allegro_2012-01-01; Manufacturer_Part_Number: ACS756SCA-050B-PFF-T; Copyright: Copyright (C) 2018 Accelerated Designs. All rights reserved; RefDes: RefDes; Type: DEV
U14 U17 U22 = TPS54140ADGQ: 3.5V to 42V Input, 1.5A Step-Down Converter with Eco-Mode 10-HVSSOP -40 to 125; MF: Texas Instruments; SnapEDA_Link: https://www.snapeda.com/parts/TPS54140ADGQ/Texas%20Instruments/view-part/1101421/?ref=snap; Check_prices: https://www.snapeda.com/parts/TPS54140ADGQ/Texas%20Instruments/view-part/1101421/?ref=eda; Availability: Good; Value: *; MP: TPS54140ADGQ; Package: HVSSOP-10 Texas Instruments; Purchase-URL: https://pricing.snapeda.com/search/part/TPS54140ADGQ/?ref=eda; Price: None
U29 = HCM1205: No Description Available; Vendor: Kingstate Electronics; Built_By: EMA_Cory; Manufacturer_Part_Number: HCM1205; Copyright: Copyright (C) 2018 Accelerated Designs. All rights reserved; RefDes: RefDes; Type: DEV; Value: Value
VD1-VD6 VD8-VD17 = MURS120T: No Description Available; Vendor: Vishay; Built_By: EMA_UL_Team; Type: DEV; Manufacturer_Part_Number: MURS120T; Copyright: Copyright (C) 2018 Accelerated Designs. All rights reserved; RefDes: RefDes; Value: Value
VD7 = VS-10BQ040PBF: No Description Available; Vendor: Vishay; Built_By: EMA_UL_Team; Type: DEV; Manufacturer_Part_Number: VS-10BQ040PBF; Copyright: Copyright (C) 2018 Accelerated Designs. All rights reserved; RefDes: RefDes; Value: Value
VT1-VT32 = IRFB3077PBF: No Description Available; Vendor: Infineon; Built_By: EMA_UL_Team; Type: DEV; Manufacturer_Part_Number: IRFB3077PBF; Copyright: Copyright (C) 2018 Accelerated Designs. All rights reserved; RefDes: RefDes; Value: Value
VT33 = 2N7002,215: No Description Available; Vendor: Nexperia; Type: DEV; Manufacturer_Part_Number: 2N7002,215; Copyright: Copyright (C) 2016 Accelerated Designs. All rights reserved; RefDes: RefDes; Value: Value
X3 X4 = B4B-XH-A (LF)(SN: No Description Available; Vendor: JST; Built_By: EMA_Cory; Datasheet: http://www.jst-mfg.com/product/pdf/eng/eXH.pdf; Manufacturer_Part_Number: B4B-XH-A (LF)(SN); Copyright: Copyright (C) 2018 Accelerated Designs. All rights reserved; RefDes: RefDes; Type: DEV; Value: Value
X5 = XT60